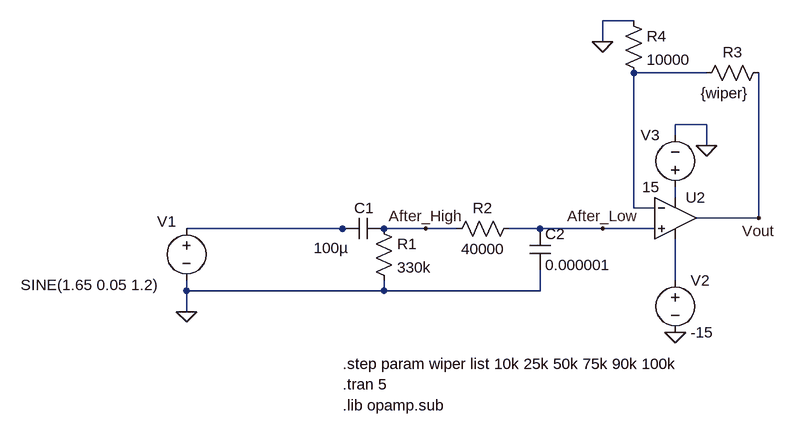
[diagram p0: schematic Op-Amp Filter.asc]
Op-Amp Filter.asc, the LTspice schematic file:
Version 4.1
SHEET 1 972 680
WIRE 736 -272 688 -272
WIRE 688 -240 688 -272
WIRE 848 -192 736 -192
WIRE 848 -112 800 -112
WIRE 800 -96 800 -112
WIRE 848 -80 848 -112
WIRE 800 0 800 -16
WIRE 736 16 736 -192
WIRE 768 16 736 16
WIRE 928 32 928 -192
WIRE 928 32 832 32
WIRE 288 48 48 48
WIRE 304 48 288 48
WIRE 416 48 352 48
WIRE 464 48 416 48
WIRE 592 48 544 48
WIRE 688 48 592 48
WIRE 768 48 688 48
WIRE 800 128 800 64
WIRE 48 144 48 128
WIRE 352 144 352 128
WIRE 352 144 48 144
WIRE 592 144 592 112
WIRE 592 144 352 144
WIRE 48 176 48 144
FLAG 688 -240 0
FLAG 800 208 0
FLAG 848 -80 0
FLAG 928 32 Vout
FLAG 416 48 After_High
FLAG 688 48 After_Low
FLAG 48 176 0
SYMBOL voltage 48 32 R0
WINDOW 0 -45 5 Left 2
WINDOW 3 -255 103 Left 2
WINDOW 123 0 0 Left 0
WINDOW 39 0 0 Left 0
SYMATTR InstName V1
SYMATTR Value SINE(1.65 0.05 1.2)
SYMBOL cap 352 32 R90
WINDOW 0 0 31 VBottom 2
WINDOW 3 30 81 VTop 2
SYMATTR InstName C1
SYMATTR Value 100µ
SYMBOL res 336 32 R0
SYMATTR InstName R1
SYMATTR Value 330k
SYMBOL res 560 32 R90
WINDOW 0 0 56 VBottom 2
WINDOW 3 32 56 VTop 2
SYMATTR InstName R2
SYMATTR Value 40000
SYMBOL cap 576 48 R0
SYMATTR InstName C2
SYMATTR Value 0.000001
SYMBOL res 944 -208 R90
WINDOW 0 0 56 VBottom 2
WINDOW 3 32 68 VTop 2
SYMATTR InstName R3
SYMATTR Value {wiper}
SYMBOL res 720 -288 R0
SYMATTR InstName R4
SYMATTR Value 10000
SYMBOL OpAmps\\UniversalOpAmp2 800 32 R0
SYMATTR InstName U2
SYMBOL voltage 800 112 R0
WINDOW 123 0 0 Left 0
WINDOW 39 0 0 Left 0
SYMATTR InstName V2
SYMATTR Value -15
SYMBOL voltage 800 0 R180
WINDOW 0 24 96 Left 2
WINDOW 3 24 16 Left 2
WINDOW 123 0 0 Left 0
WINDOW 39 0 0 Left 0
SYMATTR InstName V3
SYMATTR Value 15
TEXT 288 256 Left 2 !.step param wiper list 10k 25k 50k 75k 90k 100k
TEXT 288 288 Left 2 !.tran 5
TEXT 288 320 Left 2 !.lib opamp.sub

The netlist it stands for:
* Op-Amp Filter.asc
V1 N003 0 SINE(1.65 0.05 1.2)
C1 After_High N003 100µ
R1 After_High 0 330k
R2 After_Low After_High 40000
C2 After_Low 0 0.000001
R3 Vout N001 {wiper}
R4 0 N001 10000
X§U2 After_Low N001 N002 N004 Vout level2 Avol=1Meg GBW=10Meg Slew=10Meg Ilimit=25m Rail=0 Vos=0 En=0 Enk=0 In=0 Ink=0 Rin=500Meg  ; pins In+ In- V+ V- OUT
V2 N004 0 -15
V3 N002 0 15
.step param wiper list 10k 25k 50k 75k 90k 100k
.tran 5
.lib opamp.sub
.lib UniversalOpAmp2.lib
.backanno
.end